# Altium schematic sheet LED_Driver.SchDoc
size A; SheetNumber: 1; SheetTotal: 1
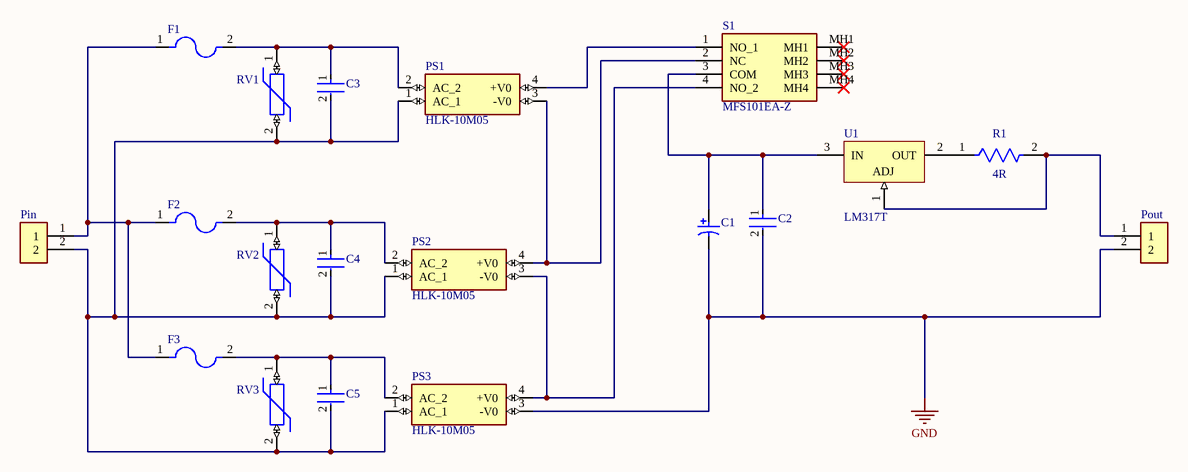
[diagram p0: LED_Driver.SchDoc]

## Parts
C1  ECA-1VM221  [PNSC-ECA-1VM221-2]  (value not drawn)
C2  C322C104K5R5TA  [FP-C322C104K5R5TA-MFG]  (value not drawn)
C3  C322C104K5R5TA  [FP-C322C104K5R5TA-MFG]  (value not drawn)
C4  C322C104K5R5TA  [FP-C322C104K5R5TA-MFG]  (value not drawn)
C5  C322C104K5R5TA  [FP-C322C104K5R5TA-MFG]  (value not drawn)
F1  5MFP-700-R  [FUSAD2668W81L2100D550]  (value not drawn)
F2  5MFP-700-R  [FUSAD2668W81L2100D550]  (value not drawn)
F3  5MFP-700-R  [FUSAD2668W81L2100D550]  (value not drawn)
Pin  282837-2  [TE_282837-2]  (value not drawn)
Pout  282837-2  [TE_282837-2]  (value not drawn)
PS1  HLK-10M05  [HLK10M05]
PS2  HLK-10M05  [HLK10M05]
PS3  HLK-10M05  [HLK10M05]
R1  Resistance: 4R  [FP-SP3A-MFG]  (hidden comment: SP3AJT10R0)
RV1  MOV-07D470K  [MOV-07DXXXK(3.9T)]  (value not drawn)
RV2  MOV-07D470K  [MOV-07DXXXK(3.9T)]  (value not drawn)
RV3  MOV-07D470K  [MOV-07DXXXK(3.9T)]  (value not drawn)
S1  MFS101EA-Z  [MFS101EAZ]
U1  LM317T  [TO-220]

## Nets
GND: C1.2 C2.2 Pout.2 PS3.3(-V0)
NetC1_1: C1.1 C2.1 S1.3(COM) U1.3(IN)
NetC3_1: C3.1 F1.2 PS1.2(AC_2) RV1.1
NetC3_2: C3.2 C4.2 C5.2 Pin.2 PS1.1(AC_1) PS2.1(AC_1) PS3.1(AC_1) RV1.2 RV2.2 RV3.2
NetC4_1: C4.1 F2.2 PS2.2(AC_2) RV2.1
NetC5_1: C5.1 F3.2 PS3.2(AC_2) RV3.1
NetF1_1: F1.1 F2.1 F3.1 Pin.1
NetPout_1: Pout.1 R1.2 U1.1(ADJ)
NetPS1_3: PS1.3(-V0) PS2.4(+V0) S1.2(NC)
NetPS1_4: PS1.4(+V0) S1.1(NO_1)
NetPS2_3: PS2.3(-V0) PS3.4(+V0) S1.4(NO_2)
NetR1_1: R1.1 U1.2(OUT)

Not connected (* = marked no-connect by the designer): S1 MH1* MH2* MH3* MH4*

## Library data of the parts
C1 = CMP-2000-05311-1: Aluminum Electrolytic Capacitor, 220 uF, +/- 20%, 35 V, -40 to 85 degC, 2-Pin THD, RoHS, Bulk; Manufacturer: Panasonic; Lifetime@Temperature: 2000Hrs@85degC; Rated Voltage: 35V; Ripple Current: 350mA; Type: Radial; Capacitance: 220µF; Package Reference: ECA-1VM221; Series: M; Operating Temp Range: -40to+85degC; Package Description: 2-Pin Axial Lead, Dia 8 mm, Body Length 12.5 mm; Datasheet Version: Mar-06; Datasheet URL: https://datasheet.ciiva.com/26341/441851-da-01-en-elko-eca1vm221-m-r-220myf-35v-85c-26341906.pdf; Operating Temp-Max: 85degC; Case Size/Dimension: Ø8x11.5mm; Manufacturer URL: http://www.panasonic.com/
C2-C5 = CMP-03020-034661-1: CAP CER 0.1UF 50V X7R RADIAL; Capacitance: 100nF; Dielectric Material: Ceramic; Dissipation Factor: 2.5%; Lead Length: 7mm; Tolerance: 10%; Lead Diameter: 0.51mm; Lead/Base Style: Formed Leads; Construction: RADIAL; RoHS Compliant: Yes; Voltage Rating (DC): 50V; Packaging: Bulk; Lead Free: Lead Free; Width: 0.125inch; Lead Pitch: 5.08mm; Voltage Rating: 50V; Number of Pins: 2; Radiation Hardening: No; Material: Ceramic; REACH SVHC: No SVHC; Height - Seated (Max): 0.26inch; Case/Package: Radial; Weight: 0.0625lb; Dielectric: X7R; Min Operating Temperature: -55°C; Voltage: 50V; Series: Golden Max™; Max Operating Temperature: 125°C; Height: 3.18mm; Termination: Radial; Length: 5.08mm; Depth: 3.18mm; Package Quantity: 500; Mount: Through Hole
F1-F3 = 5MFP-700-R: 5MFP 1-R (0651R1000-33) | Glass Tube Fuse | Axial Pigtail 5x20mm | UL | Fast Blow | 1A; Package: None; Price: None; Value: *; MP: 5MFP-700-R; Availability: Unavailable
Pin Pout = 282837-2: Ð Ð°Ð·ÑŠÐµÐ¼Ð½Ñ‹Ðµ ÐºÐ»ÐµÐ¼Ð¼Ð½Ñ‹Ðµ ÐºÐ¾Ð»Ð¾Ð´ÐºÐ¸ Ð Ð¾Ð·ÐµÑ‚ÐºÐ° 2 Ð¿Ð¾Ð»Ð¾Ð¶ÐµÐ½Ð¸Ñ 5,08 Ð¼Ð¼ ÐŸÑ€Ð¸Ð¿Ð¾Ð¹ Ð¿Ñ€ÑÐ¼Ð¾Ð¹ Ñ‡ÐµÑ€ÐµÐ· Ð¾Ñ‚Ð²ÐµÑ€ÑÑ‚Ð¸Ðµ 13,5 Ð / ÐºÐ¾Ð½Ñ‚Ð°ÐºÑ‚; MF: TE Connectivity; SnapEDA_Link: https://www.snapeda.com/parts/282837-2/TE+Connectivity+AMP+Connectors/view-part/?ref=snap; Price: None; Check_prices: https://www.snapeda.com/parts/282837-2/TE+Connectivity+AMP+Connectors/view-part/?ref=eda; Purchase-URL: https://pricing.snapeda.com/search/part/282837-2/?ref=eda; MP: 282837-2; Value: *; Availability: In Stock; Package: None
PS1-PS3 = HLK-10M05: 10W Ultra-Compact Power Module; MF: Hi-link; SnapEDA_Link: https://www.snapeda.com/parts/HLK-10M05/Hi-link/view-part/?ref=snap; Price: None; Check_prices: https://www.snapeda.com/parts/HLK-10M05/Hi-link/view-part/?ref=eda; MP: HLK-10M05; Availability: Not in stock; Value: *; Package: Package
R1 = CMP-26528-000004-1: RES 10 OHM 5% 4W AXIAL; Temperature Coefficient: 20ppm/°C; Power Rating: 4W; Series: SP; Mount: Through Hole; Diameter: 5.5mm; RoHS Compliant: Yes; Length: 12.7mm; Max Operating Temperature: 350°C; Max Power Dissipation: 4W; Number of Terminations: 2; Resistor Type: Wirewound; Min Operating Temperature: -55°C; Case/Package: Axial; Tolerance: 5%; Package Quantity: 1; Packaging: Cut Tape
RV1-RV3 = MOV-07D470K: 47 V 250 A Varistor 1 Circuit Through Hole Disc 7mm; MF: Bourns; Package: Disc-7 Bourns; Purchase-URL: https://pricing.snapeda.com/search/part/MOV-07D470K/?ref=eda; MP: MOV-07D470K; Value: *; Availability: In Stock; SnapEDA_Link: https://www.snapeda.com/parts/MOV-07D470K/Bourns/view-part/?ref=snap; Price: None; Check_prices: https://www.snapeda.com/parts/MOV-07D470K/Bourns/view-part/?ref=eda
S1 = MFS101EA-Z: Switch; Manufacturer_Name: NIDEC COPAL; Datasheet Link: https://www.mouser.com/datasheet/2/972/mfs-1827296.pdf; Height: 7.8mm; Manufacturer_Part_Number: MFS101EA-Z; Mouser Part Number: 229-MFS101EA-Z; Mouser Price/Stock: https://www.mouser.co.uk/ProductDetail/Nidec-Copal/MFS101EA-Z?qs=XeJtXLiO41Tf52XT6VD6gg%3D%3D
U1 = CMP-0244-00444-1: 1.5A, 1.2V to 37V Adjustable Voltage Regulator, 3-Pin TO-220; PackageVersion: 2011; ComponentLink1URL: http://www.st.com; ComponentLink2URL: http://www.st.com/internet/com/TECHNICAL_RESOURCES/TECHNICAL_LITERATURE/DATASHEET/CD00000455.pdf; PackageDescription: TO, Thru-Hole, Vertical, Heatsink Mounted; 3 In-Line Leads; Pitch 2.54 mm; PackageReference: TO-220; ComponentLink1Description: Manufacturer URL; ComponentLink3URL: http://www.st.com/internet/com/TECHNICAL_RESOURCES/TECHNICAL_LITERATURE/PACKAGE_INFORMATION/CD00004649.pdf; DatasheetVersion: 1/11/2011; ComponentLink2Description: Datasheet; ComponentLink3Description: Package Specification